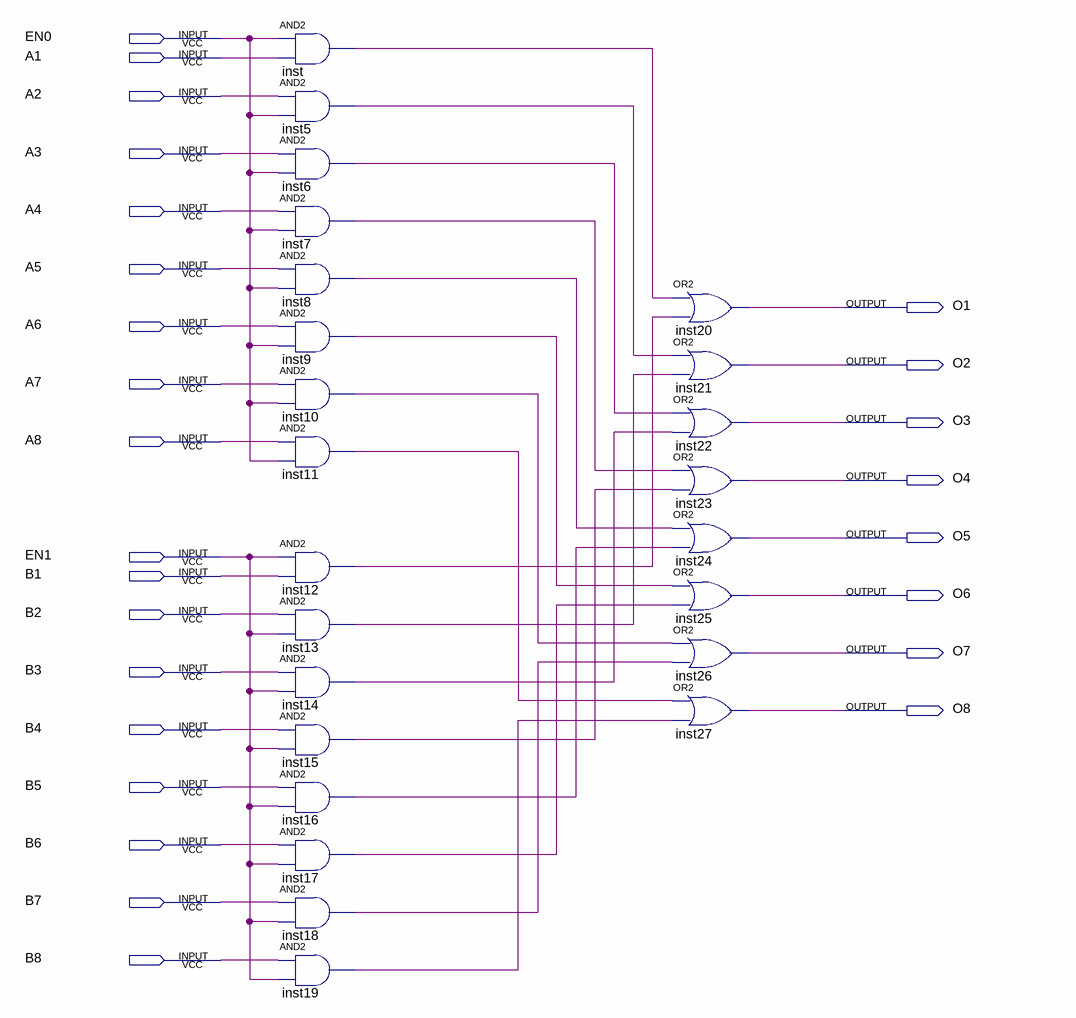
[diagram p0: schematic sheet]
// Quartus schematic 2C1.bdf as structural Verilog: 24 symbols, 26 pins
module \2C1  (
  input  EN0,
  input  A1,
  input  A2,
  input  A3,
  input  A4,
  input  A5,
  input  A6,
  input  A7,
  input  A8,
  input  EN1,
  input  B1,
  input  B2,
  input  B3,
  input  B4,
  input  B5,
  input  B6,
  input  B7,
  input  B8,
  output O1,
  output O2,
  output O3,
  output O4,
  output O5,
  output O6,
  output O7,
  output O8
);

  wire inst5_out, inst6_out, inst7_out, inst8_out, inst9_out, inst10_out, inst11_out, inst12_out, inst13_out,
       inst14_out, inst15_out, inst16_out, inst17_out, inst18_out, inst19_out, inst_out;

  and inst (inst_out, EN0, A1);
  and inst5 (inst5_out, A2, EN0);
  and inst6 (inst6_out, A3, EN0);
  and inst7 (inst7_out, A4, EN0);
  and inst8 (inst8_out, A5, EN0);
  and inst9 (inst9_out, A6, EN0);
  and inst10 (inst10_out, A7, EN0);
  and inst11 (inst11_out, A8, EN0);
  and inst12 (inst12_out, EN1, B1);
  and inst13 (inst13_out, B2, EN1);
  and inst14 (inst14_out, B3, EN1);
  and inst15 (inst15_out, B4, EN1);
  and inst16 (inst16_out, B5, EN1);
  and inst17 (inst17_out, B6, EN1);
  and inst18 (inst18_out, B7, EN1);
  and inst19 (inst19_out, B8, EN1);
  or inst20 (O1, inst_out, inst12_out);
  or inst21 (O2, inst5_out, inst13_out);
  or inst22 (O3, inst6_out, inst14_out);
  or inst23 (O4, inst7_out, inst15_out);
  or inst24 (O5, inst8_out, inst16_out);
  or inst25 (O6, inst9_out, inst17_out);
  or inst26 (O7, inst10_out, inst18_out);
  or inst27 (O8, inst11_out, inst19_out);
endmodule
